# Altium schematic sheet AAS_module_TOP-rev1_2.SchDoc: TOP
size A4; Author: Richard Kubíček; DocumentNumber: 1; SheetNumber: 1; SheetTotal: 4; PageSize: A4; DruhPraceRadek1: Diplomová; DruhPraceRadek2: práce
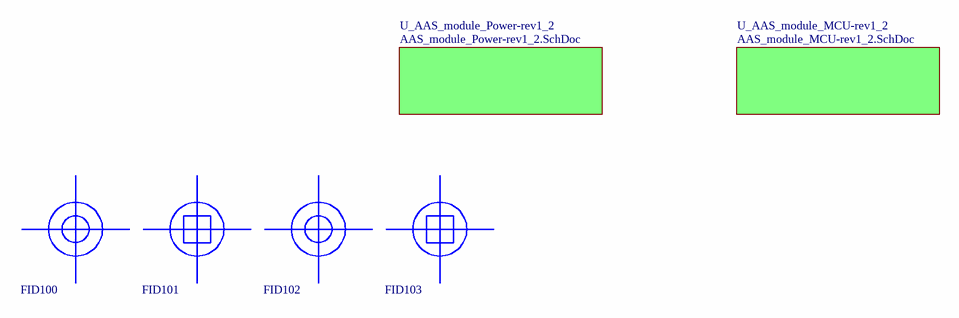
[diagram p0: AAS_module_TOP-rev1_2.SchDoc]

## Parts
FID100  FID_CIRCLE  [FID-CIRCLE1MM]  (value not drawn)
FID101  FID_SQUARE  [FID-SQUARE1MM]  (value not drawn)
FID102  FID_CIRCLE  [FID-CIRCLE1MM]  (value not drawn)
FID103  FID_SQUARE  [FID-SQUARE1MM]  (value not drawn)

## Sub-sheets
U_AAS_module_MCU-rev1_2 = AAS_module_MCU-rev1_2.SchDoc: no entries
U_AAS_module_Power-rev1_2 = AAS_module_Power-rev1_2.SchDoc: no entries

## Notes on the sheet
- Druh práce
- Název dokumentu
- Projekt
- Autor
- Revize
- Strana